# Altium schematic sheet USB.SchDoc
size A4; Organization: Altium Limited; Address1: L3, 12a Rodborough Rd; Address2: Frenchs Forest; Address3: NSW; Address4: Australia 2086
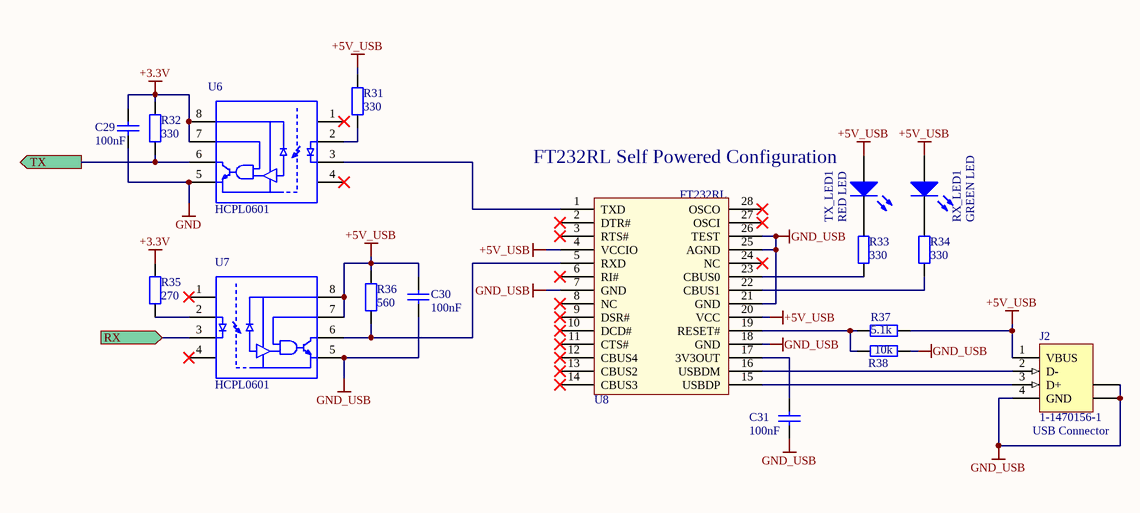
[diagram p0: USB.SchDoc]

## Parts
C29  value 100nF  [1206_REFLOW]  (hidden comment: Cap 1206)
C30  value 100nF  [1206_REFLOW]  (hidden comment: Cap 1206)
C31  value 100nF  [3216[1206]]  (hidden comment: Cap)
J2  1-1470156-1  [USB2.5-2H4D]
R31  value 330  [1206_REFLOW]  (hidden comment: RES)
R32  value 330  [1206_REFLOW]  (hidden comment: RES)
R33  value 330  [3216[1206]]  (hidden comment: Resistor)
R34  value 330  [3216[1206]]  (hidden comment: Resistor)
R35  value 270  [1206_REFLOW]  (hidden comment: RES)
R36  value 560  [1206_REFLOW]  (hidden comment: RES)
R37  value 5.1k  [3216[1206]]  (hidden comment: Resistor)
R38  value 10k  [3216[1206]]  (hidden comment: Resistor)
RX_LED1  GREEN LED  [LED_1206]
TX_LED1  RED LED  [LED_1206]
U6  HCPL0601  [SO8_HIS]
U7  HCPL0601  [SO8_HIS]
U8  FT232RL  [SSOP28]

## Ports
RX (in), TX (out)

## Nets
+3.3V: C29.1 R32.1 R35.1 U6.7(Ve) U6.8(Vcc)
+5V_USB: C30.1 J2.1(VBUS) R31.1 R36.1 R37.2 RX_LED1.A TX_LED1.A U7.7(Ve) U7.8(Vcc) U8.4(VCCIO) U8.20(VCC)
GND: C29.2 U6.5(GND)
GND_USB: C30.2 C31.1 J2.4(GND) J2.5(SHLD) J2.6(SHLD) R38.1 U7.5(GND) U8.7(GND) U8.18(GND) U8.21(GND) U8.25(AGND) U8.26(TEST)
RX: U7.3(Vf-) ; port RX
TX: R32.2 U6.6(Vo) ; port TX
NetC31_2: C31.2 U8.17(3V3OUT)
NetJ2_2: J2.2(D-) U8.16(USBDM)
NetJ2_3: J2.3(D+) U8.15(USBDP)
NetR31_2: R31.2 U6.2(Vf+)
NetR33_1: R33.1 U8.23(CBUS0)
NetR33_2: R33.2 TX_LED1.K
NetR34_1: R34.1 U8.22(CBUS1)
NetR34_2: R34.2 RX_LED1.K
NetR35_2: R35.2 U7.2(Vf+)
NetR36_2: R36.2 U7.6(Vo) U8.5(RXD)
NetR37_1: R37.1 R38.2 U8.19(RESET#)
NetU6_3: U6.3(Vf-) U8.1(TXD)

Not connected (* = marked no-connect by the designer): U6 1(N/C)* 4(N/C)*; U7 1(N/C)* 4(N/C)*; U8 2(DTR#)* 3(RTS#)* 6(RI#)* 8(NC)* 9(DSR#)* 10(DCD#)* 11(CTS#)* 12(CBUS4)* 13(CBUS2)* 14(CBUS3)* 24(NC)* 27(OSCI)* 28(OSCO)*

## Notes on the sheet
- (near TX_LED1) FT232RL Self Powered Configuration
- (near J2) USB Connector
- Title
- Size:
- Date:
- A4
- Number:
- Time:
- Revision:
- Sheet
- of
- File:

## Library data of the parts
J2 = 1-1470156-1: USB 1.1, Right Angle, Thru-Hole, B Type, Receptacle, 4 Position, White; ContactMaterial: Phosphor Bronze; ContactPlating: Gold over Nickel; TerminationLength: 3.00mm [0.118in.]; PCB_Layout: Complies with manufacturer's recommendation.; DrillSize: Corresponds to nominal value.; PanelGround: Without; Published: 15-Jul-2004; DatasheetDocument: 02-Jun-2001; PackageDocument: 02-Jun-2001; PackageReference: 1-1470156; Publisher: Altium Limited; HousingMaterial: Glass-Filled Thermoplastic; ComponentLink1Description: Manufacturer Link; ComponentLink1URL: http://www.tycoelectronics.com/; ComponentLink2Description: Packaging Specification; ComponentLink2URL: http://ecommas.tycoelectronics.com/commerce/DocumentDelivery/DDEController?Action=showdoc&DocId=Customer+Drawing%7F1470156%7FO%7Ftif%7FEnglish%7FC_1470156_O.tif
R31 R32 R35 R36 = RES 1
R33 R34 R37 R38 = RES1
RX_LED1 TX_LED1 = LED: Value: TBD
U6 U7 = HCPL0601: Value: HCPL0601
U8 = FT232RL: Value: FT232RL